# Altium project analogtestboard.PRJPCB
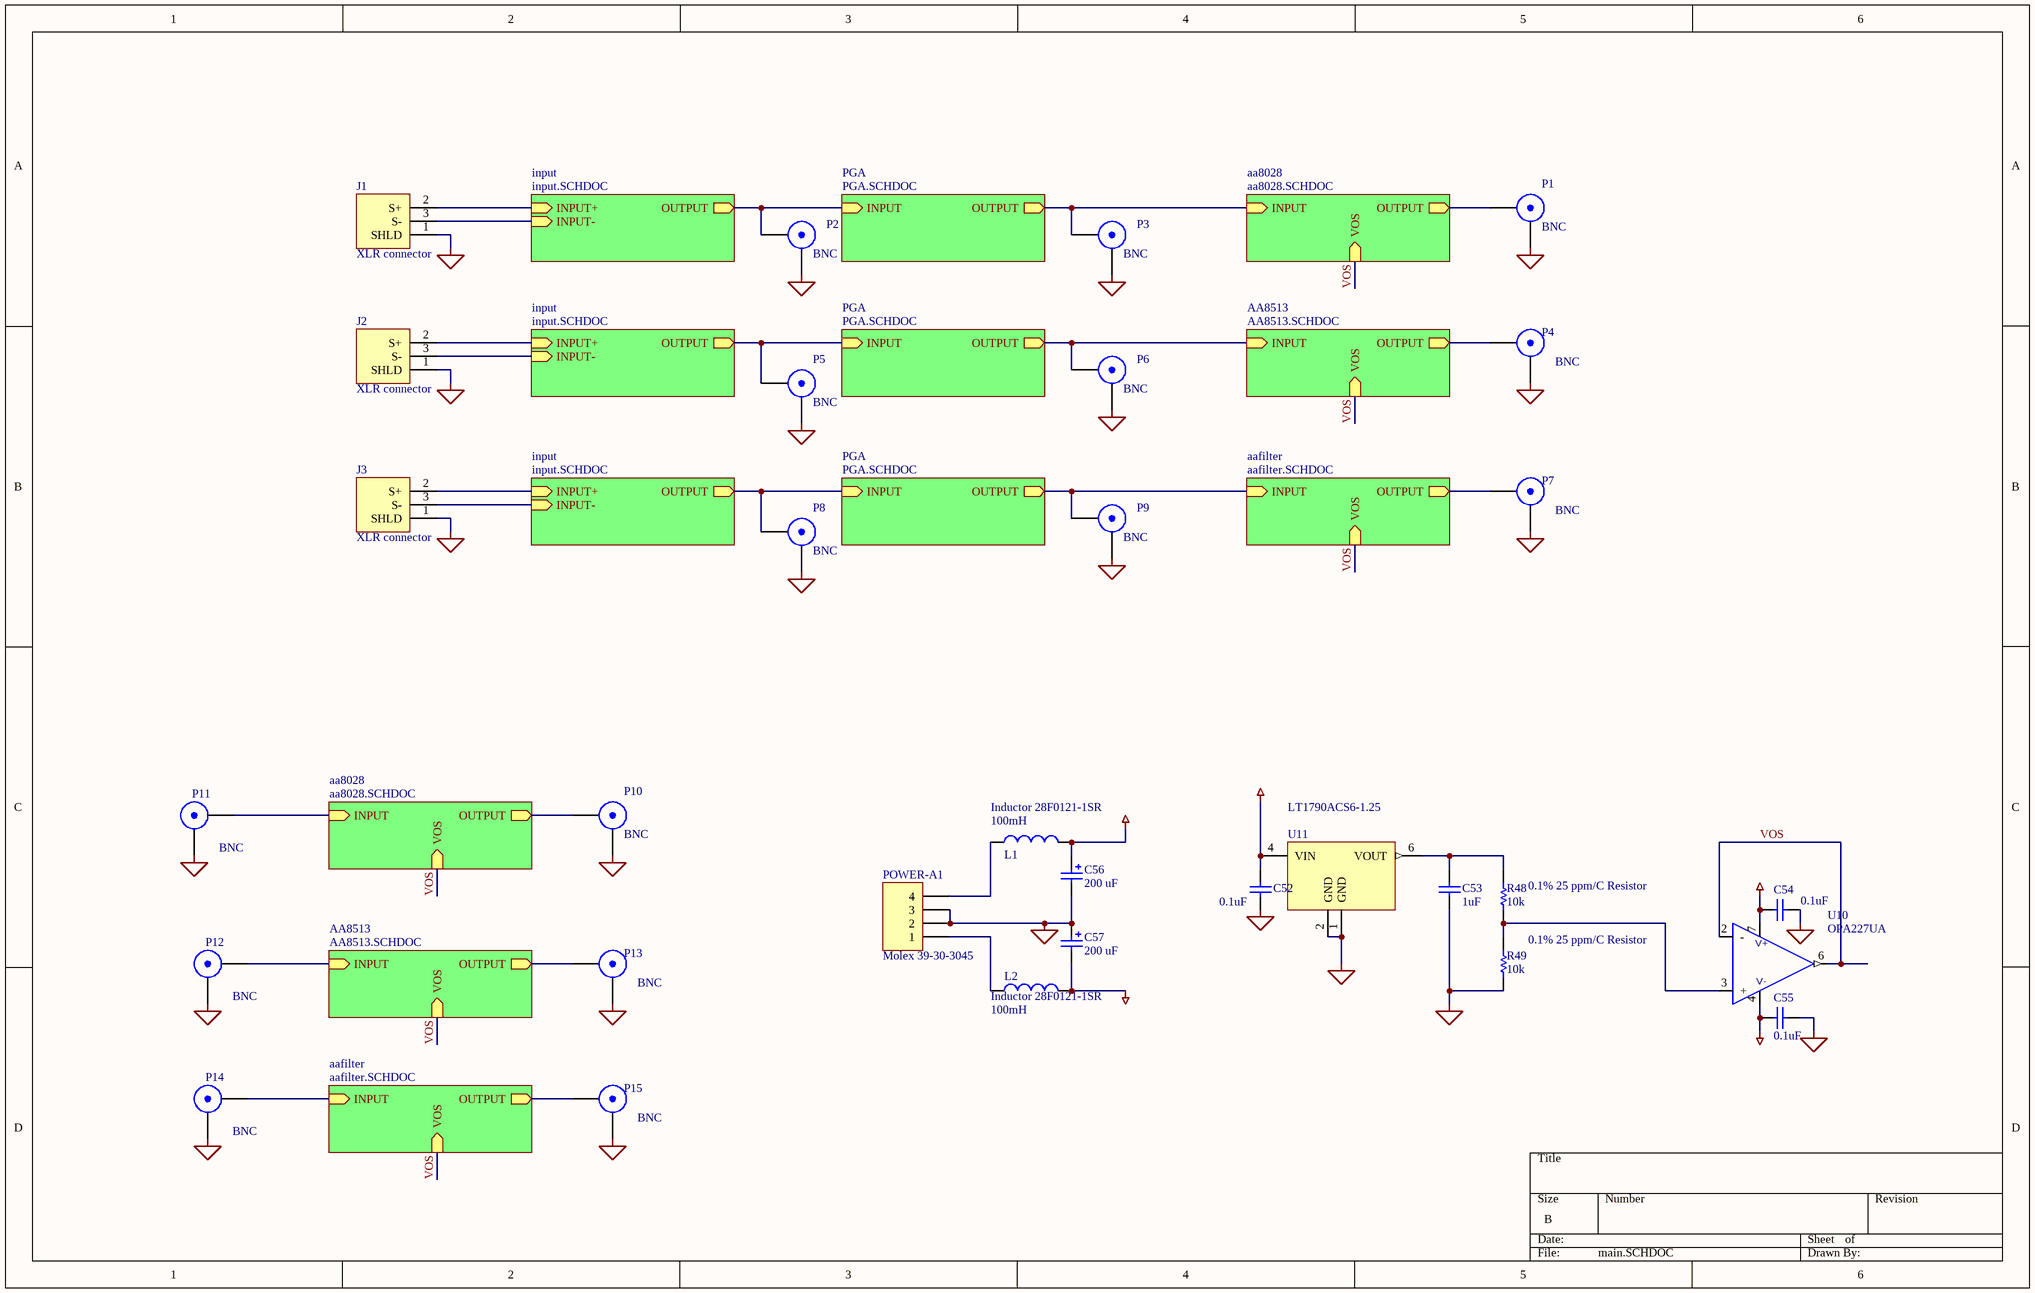
[diagram p0: main.SCHDOC]
5 sheets, 273 parts. Net scope: hierarchical (ports join the sheet entries above them; power ports are global).
Board file: analogtestboard.PCBDOC
Sheets:
  main.SCHDOC
    aa8028 = aa8028.SCHDOC
    AA8513 = AA8513.SCHDOC
    PGA = PGA.SCHDOC
    PGA = PGA.SCHDOC
    aafilter = aafilter.SCHDOC
    aa8028 = aa8028.SCHDOC
    AA8513 = AA8513.SCHDOC
    aafilter = aafilter.SCHDOC
    PGA = PGA.SCHDOC

## Sheet main.SCHDOC
size B

### Parts
(Parts that share a designator on the sheet are numbered #1, #2 ... from top to bottom, then left to right.)
C52#1  value 0.1uF  [CC1608-0603]  (hidden comment: Cap)
C53#1  value 1uF  [CC1608-0603]  (hidden comment: Cap)
C54#1  value 0.1uF  [CC1608-0603]  (hidden comment: Cap)
C55#1  value 0.1uF  [CC1608-0603]  (hidden comment: Cap)
C56  value 200 uF  [PanasonicE]
C57  value 200 uF  [PanasonicE]
J1  XLR connector  [NC3FAH-0]
J2  XLR connector  [NC3FAH-0]
J3  XLR connector  [NC3FAH-0]
L1  Inductor 28F0121-1SR  value 100mH  [STEWARD_1SR]
L2  Inductor 28F0121-1SR  value 100mH  [STEWARD_1SR]
P1  BNC  [Vertical BNC 227699-1]
P2  BNC  [Vertical BNC 227699-1]
P3  BNC  [Vertical BNC 227699-1]
P4  BNC  [Vertical BNC 227699-1]
P5  BNC  [Vertical BNC 227699-1]
P6  BNC  [Vertical BNC 227699-1]
P7  BNC  [Vertical BNC 227699-1]
P8  BNC  [Vertical BNC 227699-1]
P9  BNC  [Vertical BNC 227699-1]
P10  BNC  [Vertical BNC 227699-1]
P11  BNC  [Vertical BNC 227699-1]
P12  BNC  [Vertical BNC 227699-1]
P13  BNC  [Vertical BNC 227699-1]
P14  BNC  [Vertical BNC 227699-1]
P15  BNC  [Vertical BNC 227699-1]
POWER-A1  Molex 39-30-3045  [MJ4RTHR]
R48#1  0.1% 25 ppm/C Resistor  value 10k  [C3216-1206]
R49#1  0.1% 25 ppm/C Resistor  value 10k  [C3216-1206]
U10#1  OPA227UA  [SO-G8/D5.1]
U11#1  LT1790ACS6-1.25  [LTI SOT-23 ThinSOT]

### Sub-sheets
aa8028 = aa8028.SCHDOC: OUTPUT (out), INPUT (in), VOS (in)
aa8028 = aa8028.SCHDOC: OUTPUT (out), INPUT (in), VOS (in)
AA8513 = AA8513.SCHDOC: OUTPUT (out), INPUT (in), VOS (in)
AA8513 = AA8513.SCHDOC: OUTPUT (out), INPUT (in), VOS (in)
aafilter = aafilter.SCHDOC: INPUT (in), VOS (in), OUTPUT (out)
aafilter = aafilter.SCHDOC: INPUT (in), VOS (in), OUTPUT (out)
input = input.SCHDOC (file not in this document): INPUT+ (in), INPUT- (in), OUTPUT (out)
input = input.SCHDOC (file not in this document): INPUT+ (in), INPUT- (in), OUTPUT (out)
input = input.SCHDOC (file not in this document): INPUT+ (in), INPUT- (in), OUTPUT (out)
PGA = PGA.SCHDOC: OUTPUT (out), INPUT (in)
PGA = PGA.SCHDOC: OUTPUT (out), INPUT (in)
PGA = PGA.SCHDOC: OUTPUT (out), INPUT (in)

### Nets
AVDD: C52#1.1 C54#1.2 C56.1 L1.2 U10#1.7(V+) U11#1.4(VIN)
AVSS: C55#1.2 C57.2 L2.2 U10#1.4(V-)
GND: C52#1.2 C53#1.2 C54#1.1 C55#1.1 C56.2 C57.1 J1.1(SHLD) J2.1(SHLD) J3.1(SHLD) P1.2(Y) P2.2(Y) P3.2(Y) P4.2(Y) P5.2(Y) P6.2(Y) P7.2(Y) P8.2(Y) P9.2(Y) P10.2(Y) P11.2(Y) P12.2(Y) P13.2(Y) P14.2(Y) P15.2(Y) POWER-A1.2 POWER-A1.3 R49#1.1 U11#1.1(GND) U11#1.2(GND)
VOS: U10#1.2(-) U10#1.6(Vout) ; sheet aa8028/VOS, sheet AA8513/VOS, sheet aafilter/VOS, sheet aa8028/VOS, sheet AA8513/VOS, sheet aafilter/VOS
NetC18_1: P13.1(X) ; sheet AA8513/OUTPUT
NetC23_2: P5.1(X) ; sheet input/OUTPUT, sheet PGA/INPUT
NetC26_2: P2.1(X) ; sheet input/OUTPUT, sheet PGA/INPUT
NetC29_2: P8.1(X) ; sheet input/OUTPUT, sheet PGA/INPUT
NetC36_1: P10.1(X) ; sheet aa8028/OUTPUT
NetC53#1_1: C53#1.1 R48#1.2 U11#1.6(VOUT)
NetC63_1: P4.1(X) ; sheet AA8513/OUTPUT
NetC69_1: P7.1(X) ; sheet aafilter/OUTPUT
NetC70_1: P1.1(X) ; sheet aa8028/OUTPUT
NetC71_1: P15.1(X) ; sheet aafilter/OUTPUT
NetJ1_2: J1.2(S+) ; sheet input/INPUT+
NetJ1_3: J1.3(S-) ; sheet input/INPUT-
NetJ2_2: J2.2(S+) ; sheet input/INPUT+
NetJ2_3: J2.3(S-) ; sheet input/INPUT-
NetJ3_2: J3.2(S+) ; sheet input/INPUT+
NetJ3_3: J3.3(S-) ; sheet input/INPUT-
NetL1_1: L1.1 POWER-A1.4
NetL2_1: L2.1 POWER-A1.1
NetP3_1: P3.1(X) ; sheet PGA/OUTPUT, sheet aa8028/INPUT
NetP6_1: P6.1(X) ; sheet PGA/OUTPUT, sheet AA8513/INPUT
NetP9_1: P9.1(X) ; sheet aafilter/INPUT, sheet PGA/OUTPUT
NetP11_1: P11.1(X) ; sheet aa8028/INPUT
NetP12_1: P12.1(X) ; sheet AA8513/INPUT
NetP14_1: P14.1(X) ; sheet aafilter/INPUT
NetR48#1_1: R48#1.1 R49#1.2 U10#1.3(+)

### Library data of the parts
C52#1 C53#1 C54#1 C55#1 = Cap: Capacitor; Manufacturer: Generic Components; Class I: Passive; Published: 8-Jun-2000; Revision: July-2002: Re-released for DXP Platform.; Publisher: Altium Limited; Class II: Capacitor
C56 C57 = Cap Pol3: Polarized Capacitor (Surface Mount); Manufacturer: Generic Components; Class I: Passive; Published: 8-Jun-2000; Revision: July-2002: Re-released for DXP Platform.; Publisher: Altium Limited; Class II: Capacitor
J1-J3 = XLR: XLR balanced connector, standard
L1 L2 = Inductor: Manufacturer: Generic Components; Class I: Passive; Published: 8-Jun-2000; Revision: July-2002: Re-released for DXP Platform.; Publisher: Altium Limited; Class II: Inductor
P1-P15 = BNC: BNC Elbow Connector; Manufacturer: Generic Components; Class II: RF Coaxial; Revision: July-2002: Re-released for DXP Platform.; Publisher: Altium Limited; Class I: Connector
POWER-A1 = Header 4: Header, 4-Pin; Manufacturer: Generic Components; Class I: Connector; Revision: July-2002: Re-released for DXP Platform.; Publisher: Altium Limited
R48#1 R49#1 = Res1: Resistor; Manufacturer: Generic Components; Class I: Passive; Published: 8-Jun-2000; Revision: July-2002: Re-released for DXP Platform.; Publisher: Altium Limited; Class II: Resistor
U11#1 = LT1790

## Sheet aa8028.SCHDOC
size B
Used 2 times, as channels aa8028, aa8028. Parts and nets are listed once, with the designators drawn on the sheet.
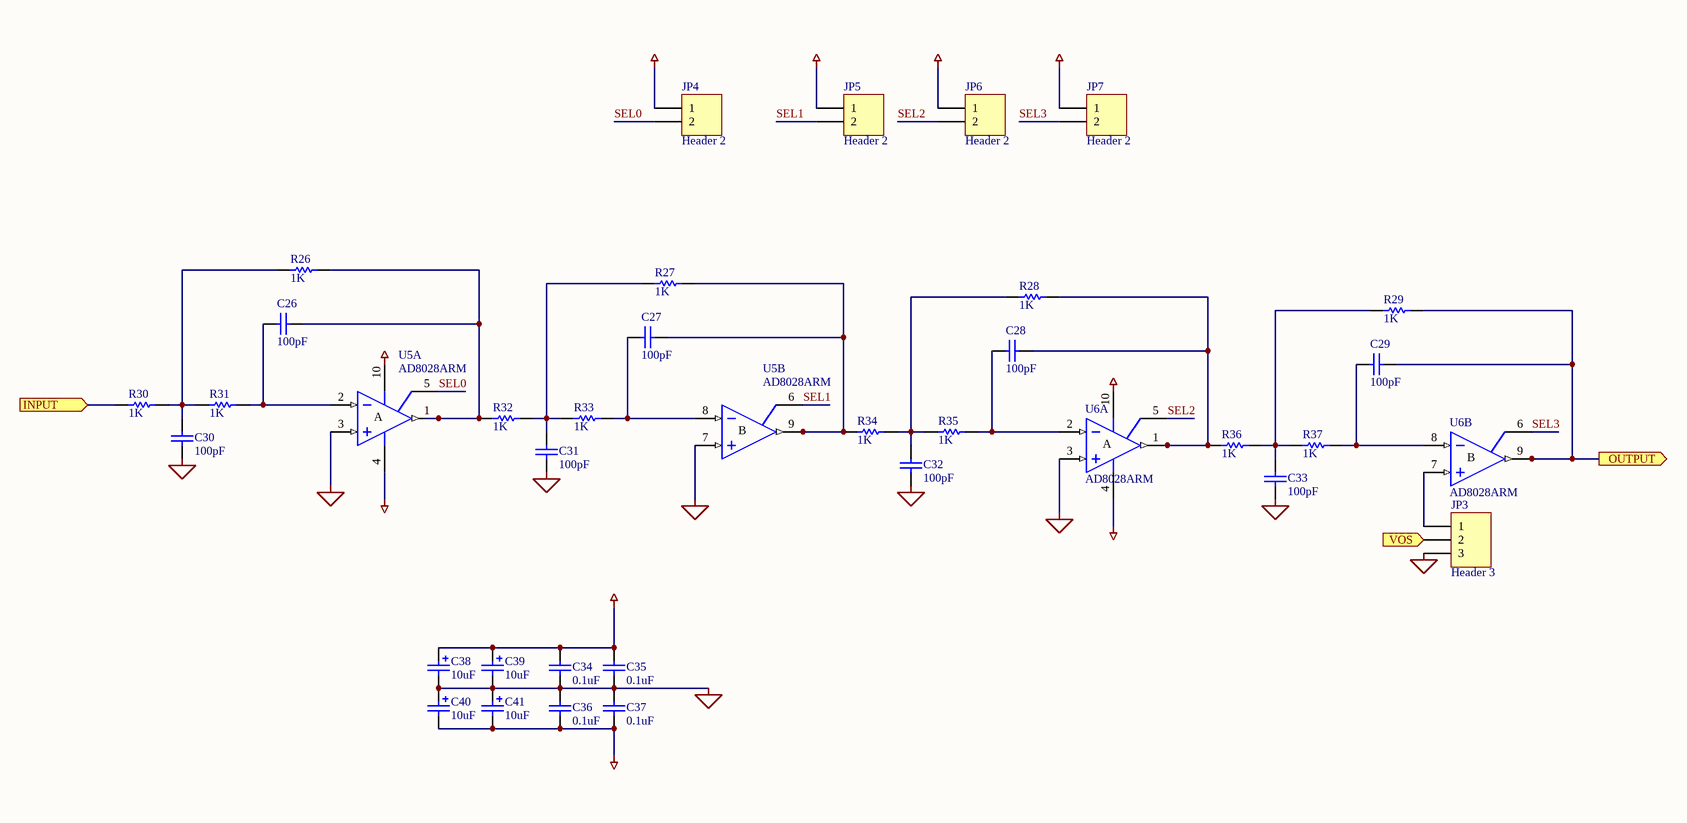
[diagram p1: aa8028.SCHDOC]

### Parts
C26  value 100pF  [CC3216-1206]  (hidden comment: Cap)
C27  value 100pF  [CC3216-1206]  (hidden comment: Cap)
C28  value 100pF  [CC3216-1206]  (hidden comment: Cap)
C29  value 100pF  [CC3216-1206]  (hidden comment: Cap)
C30  value 100pF  [CC3216-1206]  (hidden comment: Cap)
C31  value 100pF  [CC3216-1206]  (hidden comment: Cap)
C32  value 100pF  [CC3216-1206]  (hidden comment: Cap)
C33  value 100pF  [CC3216-1206]  (hidden comment: Cap)
C34  value 0.1uF  [CC1608-0603]  (hidden comment: Cap)
C35  value 0.1uF  [CC1608-0603]  (hidden comment: Cap)
C36  value 0.1uF  [CC1608-0603]  (hidden comment: Cap)
C37  value 0.1uF  [CC1608-0603]  (hidden comment: Cap)
C38  value 10uF  [TC7360-2924]  (hidden comment: Cap Pol1)
C39  value 10uF  [TC7360-2924]  (hidden comment: Cap Pol1)
C40  value 10uF  [TC7360-2924]  (hidden comment: Cap Pol1)
C41  value 10uF  [TC7360-2924]  (hidden comment: Cap Pol1)
JP3  Header 3  [HDR1X3]
JP4  Header 2  [HDR1X2]
JP5  Header 2  [HDR1X2]
JP6  Header 2  [HDR1X2]
JP7  Header 2  [HDR1X2]
R26  value 1K  [CC2012-0805]  (hidden comment: Res1)
R27  value 1K  [CC2012-0805]  (hidden comment: Res1)
R28  value 1K  [CC2012-0805]  (hidden comment: Res1)
R29  value 1K  [CC2012-0805]  (hidden comment: Res1)
R30  value 1K  [CC2012-0805]  (hidden comment: Res1)
R31  value 1K  [CC2012-0805]  (hidden comment: Res1)
R32  value 1K  [CC2012-0805]  (hidden comment: Res1)
R33  value 1K  [CC2012-0805]  (hidden comment: Res1)
R34  value 1K  [CC2012-0805]  (hidden comment: Res1)
R35  value 1K  [CC2012-0805]  (hidden comment: Res1)
R36  value 1K  [CC2012-0805]  (hidden comment: Res1)
R37  value 1K  [CC2012-0805]  (hidden comment: Res1)
U5  AD8028ARM  [TSSO3x5-G10]  (parts A,B of 2)
U6  AD8028ARM  [TSSO3x5-G10]  (parts A,B of 2)

### Ports
INPUT (in), OUTPUT (out), VOS (in)

### Nets
AVDD: C34.2 C35.2 C38.1 C39.1 JP4.1 JP5.1 JP6.1 JP7.1 U5.10(V+) U6.10(V+)
AVSS: C36.1 C37.1 C40.2 C41.2 U5.4(V-) U6.4(V-)
GND: C30.1 C31.1 C32.1 C33.1 C34.1 C35.1 C36.2 C37.2 C38.2 C39.2 C40.1 C41.1 JP3.3 U5.3(IN+A) U5.7(IN+B) U6.3(IN+A)
INPUT: R30.1 ; port INPUT
OUTPUT: C29.1 R29.1 U6.9(VOUTB) ; port OUTPUT
SEL0: JP4.2 U5.5(SELA)
SEL1: JP5.2 U5.6(SELB)
SEL2: JP6.2 U6.5(SELA)
SEL3: JP7.2 U6.6(SELB)
VOS: JP3.2 ; port VOS
NetC26_1: C26.1 R26.1 R32.1 U5.1(VOUTA)
NetC26_2: C26.2 R31.2 U5.2(IN-A)
NetC27_1: C27.1 R27.1 R34.1 U5.9(VOUTB)
NetC27_2: C27.2 R33.2 U5.8(IN-B)
NetC28_1: C28.1 R28.1 R36.1 U6.1(VOUTA)
NetC28_2: C28.2 R35.2 U6.2(IN-A)
NetC29_2: C29.2 R37.2 U6.8(IN-B)
NetC30_2: C30.2 R26.2 R30.2 R31.1
NetC31_2: C31.2 R27.2 R32.2 R33.1
NetC32_2: C32.2 R28.2 R34.2 R35.1
NetC33_2: C33.2 R29.2 R36.2 R37.1
NetJP3_1: JP3.1 U6.7(IN+B)

### Channels
aa8028: designators C26=C5 C27=C20 C28=C33 C29=C36 C30=C2 C31=C13 C32=C19 C33=C32 C34=C81 C35=C84 C36=C73 C37=C83 C38=C35 C39=C14 C40=C7 C41=C37 JP3=JP6 JP4=JP1 JP5=JP2 JP6=JP4 JP7=JP3 R26=R7 R27=R15 R28=R24 R29=R39 R30=R2 R31=R6 R32=R10 R33=R14 R34=R20 R35=R21 R36=R25 R37=R38 U5=U4 U6=U6; ports INPUT=NetP11_1 OUTPUT=NetC36_1 VOS=VOS
aa8028: designators C26=C49 C27=C59 C28=C66 C29=C70 C30=C46 C31=C54#2 C32=C58 C33=C65 C34=C99 C35=C107 C36=C98 C37=C106 C38=C68 C39=C55#2 C40=C52#2 C41=C72 JP3=JP15 JP4=JP10 JP5=JP11 JP6=JP13 JP7=JP12 R26=R75 R27=R89 R28=R101 R29=R108 R30=R67 R31=R74 R32=R80 R33=R86 R34=R96 R35=R97 R36=R105 R37=R106 U5=U18 U6=U23; ports INPUT=NetP3_1 OUTPUT=NetC70_1 VOS=VOS

### Notes on the sheet
- (in symbol AD8028ARM, part A) A
- (in symbol AD8028ARM, part B) B

### Library data of the parts
C26-C37 = Cap: as C52#1 on sheet main; Published: 8-Jun-2000; Revision: July-2002: Re-released for DXP Platform.; Publisher: Altium Limited; Class II: Capacitor
C38-C41 = Cap Pol1: Polarized Capacitor (Radial); Manufacturer: Generic Components; Class I: Passive; Published: 8-Jun-2000; Revision: July-2002: Re-released for DXP Platform.; Publisher: Altium Limited; Class II: Capacitor
JP3 = Header 3: Header, 3-Pin; Manufacturer: Generic Components; Class I: Connector; Revision: July-2002: Re-released for DXP Platform.; Publisher: Altium Limited
JP4-JP7 = Header 2: Header, 2-Pin; Manufacturer: Generic Components; Class I: Connector; Revision: July-2002: Re-released for DXP Platform.; Publisher: Altium Limited
R26-R37 = Res1: as R48#1 on sheet main; Published: 8-Jun-2000; Revision: July-2002: Re-released for DXP Platform.; Publisher: Altium Limited; Class II: Resistor
U5 U6 = AD8028ARM: Analog Devices Low Distortion, High Speed RRIO OA

## Sheet AA8513.SCHDOC
size B
Used 2 times, as channels AA8513, AA8513. Parts and nets are listed once, with the designators drawn on the sheet.
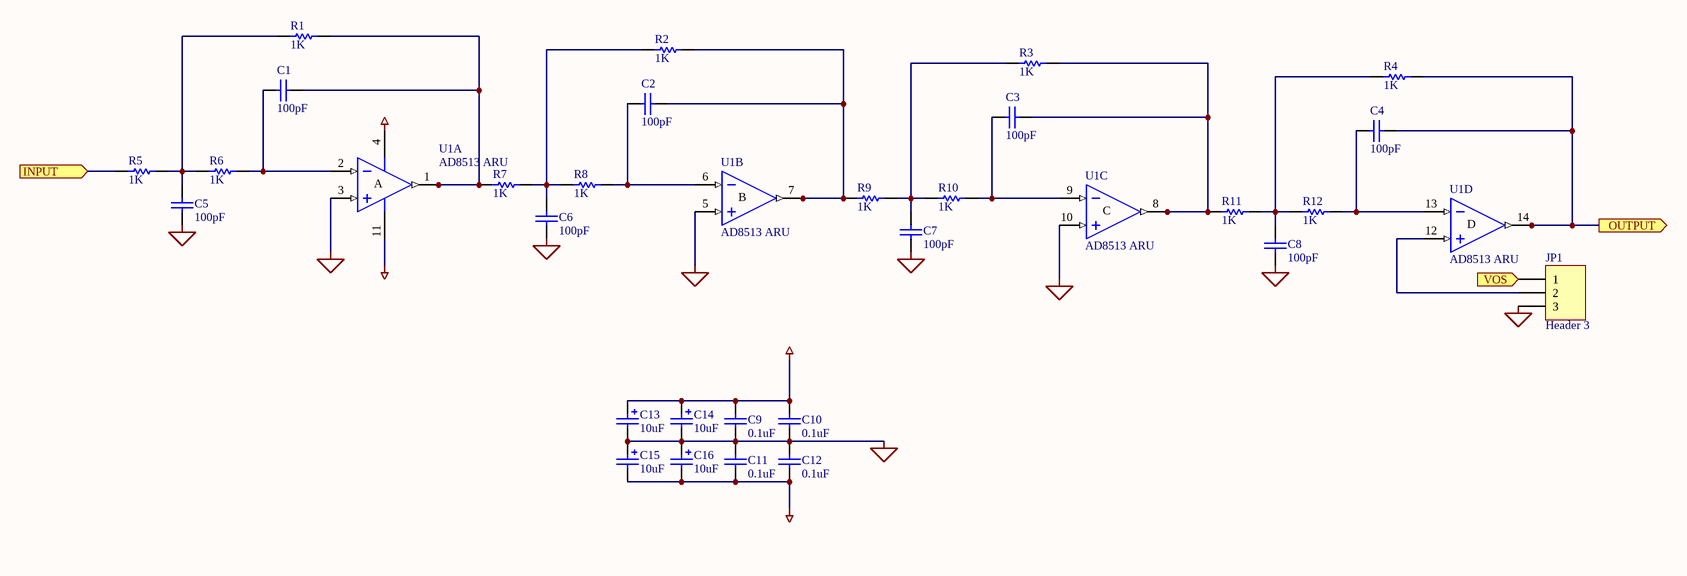
[diagram p2: AA8513.SCHDOC]

### Parts
C1  value 100pF  [CC3216-1206]  (hidden comment: Cap)
C2  value 100pF  [CC3216-1206]  (hidden comment: Cap)
C3  value 100pF  [CC3216-1206]  (hidden comment: Cap)
C4  value 100pF  [CC3216-1206]  (hidden comment: Cap)
C5  value 100pF  [CC3216-1206]  (hidden comment: Cap)
C6  value 100pF  [CC3216-1206]  (hidden comment: Cap)
C7  value 100pF  [CC3216-1206]  (hidden comment: Cap)
C8  value 100pF  [CC3216-1206]  (hidden comment: Cap)
C9  value 0.1uF  [CC1608-0603]  (hidden comment: Cap)
C10  value 0.1uF  [CC1608-0603]  (hidden comment: Cap)
C11  value 0.1uF  [CC1608-0603]  (hidden comment: Cap)
C12  value 0.1uF  [CC1608-0603]  (hidden comment: Cap)
C13  value 10uF  [TC7360-2924]  (hidden comment: Cap Pol1)
C14  value 10uF  [TC7360-2924]  (hidden comment: Cap Pol1)
C15  value 10uF  [TC7360-2924]  (hidden comment: Cap Pol1)
C16  value 10uF  [TC7360-2924]  (hidden comment: Cap Pol1)
JP1  Header 3  [HDR1X3]
R1  value 1K  [CC2012-0805]  (hidden comment: Res1)
R2  value 1K  [CC2012-0805]  (hidden comment: Res1)
R3  value 1K  [CC2012-0805]  (hidden comment: Res1)
R4  value 1K  [CC2012-0805]  (hidden comment: Res1)
R5  value 1K  [CC2012-0805]  (hidden comment: Res1)
R6  value 1K  [CC2012-0805]  (hidden comment: Res1)
R7  value 1K  [CC2012-0805]  (hidden comment: Res1)
R8  value 1K  [CC2012-0805]  (hidden comment: Res1)
R9  value 1K  [CC2012-0805]  (hidden comment: Res1)
R10  value 1K  [CC2012-0805]  (hidden comment: Res1)
R11  value 1K  [CC2012-0805]  (hidden comment: Res1)
R12  value 1K  [CC2012-0805]  (hidden comment: Res1)
U1  AD8513 ARU  [TSSO5X6-G14/X.3]  (parts A,B,C,D of 4)

### Ports
INPUT (in), OUTPUT (out), VOS (in)

### Nets
AVDD: C9.2 C10.2 C13.1 C14.1 U1.4(V+)
AVSS: C11.1 C12.1 C15.2 C16.2 U1.11(V-)
GND: C5.1 C6.1 C7.1 C8.1 C9.1 C10.1 C11.2 C12.2 C13.2 C14.2 C15.1 C16.1 JP1.3 U1.3(IN+A) U1.5(IN+B) U1.10(IN+C)
INPUT: R5.1 ; port INPUT
OUTPUT: C4.1 R4.1 U1.14(OUTD) ; port OUTPUT
VOS: JP1.1 ; port VOS
NetC1_1: C1.1 R1.1 R7.1 U1.1(OUTA)
NetC1_2: C1.2 R6.2 U1.2(IN-A)
NetC2_1: C2.1 R2.1 R9.1 U1.7(OUTB)
NetC2_2: C2.2 R8.2 U1.6(IN-B)
NetC3_1: C3.1 R3.1 R11.1 U1.8(OUTC)
NetC3_2: C3.2 R10.2 U1.9(IN-C)
NetC4_2: C4.2 R12.2 U1.13(IN-D)
NetC5_2: C5.2 R1.2 R5.2 R6.1
NetC6_2: C6.2 R2.2 R7.2 R8.1
NetC7_2: C7.2 R3.2 R9.2 R10.1
NetC8_2: C8.2 R4.2 R11.2 R12.1
NetJP1_2: JP1.2 U1.12(IN+D)

### Channels
AA8513: designators C1=C4 C2=C12 C3=C22 C4=C18 C5=C1 C6=C3 C7=C21 C8=C34 C9=C80 C10=C10_AA8513#1 C11=C82 C12=C12_AA8513#1 C13=C13_AA8513#1 C14=C11 C15=C6 C16=C16_AA8513#1 JP1=JP5 R1=R5 R2=R13 R3=R22 R4=R19 R5=R1 R6=R3 R7=R11 R8=R12 R9=R16 R10=R17 R11=R23 R12=R18 U1=U5; ports INPUT=NetP12_1 OUTPUT=NetC18_1 VOS=VOS
AA8513: designators C1=C48 C2=C53#2 C3=C62 C4=C63 C5=C45 C6=C47 C7=C61 C8=C67 C9=C101 C10=C10_AA8513#2 C11=C103 C12=C12_AA8513#2 C13=C13_AA8513#2 C14=C50 C15=C51 C16=C16_AA8513#2 JP1=JP14 R1=R79 R2=R88 R3=R100 R4=R95 R5=R71 R6=R72 R7=R84 R8=R83 R9=R90 R10=R93 R11=R104 R12=R94 U1=U20; ports INPUT=NetP6_1 OUTPUT=NetC63_1 VOS=VOS

### Notes on the sheet
- (in symbol AD8513ARU, part A) A
- (in symbol AD8513ARU, part B) B
- (in symbol AD8513ARU, part C) C
- (in symbol AD8513ARU, part D) D

### Library data of the parts
C1-C12 = Cap: as C52#1 on sheet main; Published: 8-Jun-2000; Revision: July-2002: Re-released for DXP Platform.; Publisher: Altium Limited; Class II: Capacitor
C13-C16 = Cap Pol1: as C38 on sheet aa8028; Published: 8-Jun-2000; Revision: July-2002: Re-released for DXP Platform.; Publisher: Altium Limited; Class II: Capacitor
JP1 = Header 3: as JP3 on sheet aa8028; Revision: July-2002: Re-released for DXP Platform.; Publisher: Altium Limited
R1-R12 = Res1: as R48#1 on sheet main; Published: 8-Jun-2000; Revision: July-2002: Re-released for DXP Platform.; Publisher: Altium Limited; Class II: Resistor
U1 = AD8513ARU: low-noise JFET quad OA

## Sheet PGA.SCHDOC
size B
Used 3 times, as channels PGA, PGA, PGA. Parts and nets are listed once, with the designators drawn on the sheet.
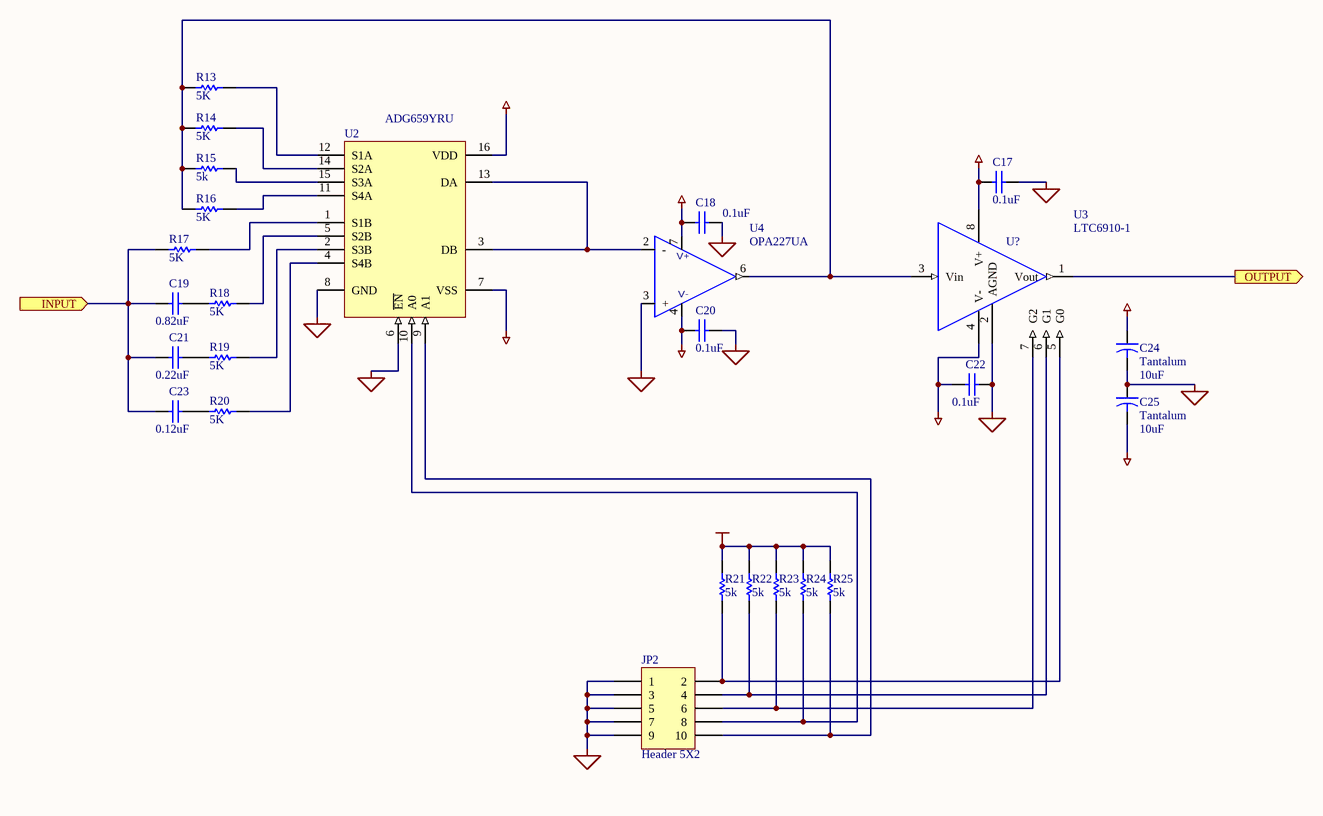
[diagram p3: PGA.SCHDOC]

### Parts
C17  value 0.1uF  [CC1608-0603]  (hidden comment: Cap)
C18  value 0.1uF  [CC1608-0603]  (hidden comment: Cap)
C19  value 0.82uF  [CC1608-0603]  (hidden comment: Cap)
C20  value 0.1uF  [CC1608-0603]  (hidden comment: Cap)
C21  value 0.22uF  [CC1608-0603]  (hidden comment: Cap)
C22  value 0.1uF  [CC1608-0603]  (hidden comment: Cap)
C23  value 0.12uF  [CC1608-0603]  (hidden comment: Cap)
C24  Tantalum  value 10uF  [TC3216-1206]
C25  Tantalum  value 10uF  [TC3216-1206]
JP2  Header 5X2  [HDR2X5]
R13  value 5K  [CC1608-0603]  (hidden comment: Res1)
R14  value 5K  [CC1608-0603]  (hidden comment: Res1)
R15  value 5k  [CC1608-0603]  (hidden comment: Res1)
R16  value 5K  [CC1608-0603]  (hidden comment: Res1)
R17  value 5K  [CC1608-0603]  (hidden comment: Res1)
R18  value 5K  [CC1608-0603]  (hidden comment: Res1)
R19  value 5K  [CC1608-0603]  (hidden comment: Res1)
R20  value 5K  [CC1608-0603]  (hidden comment: Res1)
R21  value 5k  [CC2012-0805]  (hidden comment: Res1)
R22  value 5k  [CC2012-0805]  (hidden comment: Res1)
R23  value 5k  [CC2012-0805]  (hidden comment: Res1)
R24  value 5k  [CC2012-0805]  (hidden comment: Res1)
R25  value 5k  [CC2012-0805]  (hidden comment: Res1)
U2  ADG659YRU  [TSSO5X6-G16]
U3  LTC6910-1  [TSOT-23-8]
U4  OPA227UA  [SO-G8/D5.1]

### Ports
INPUT (in), OUTPUT (out)

### Nets
AVDD: C17.1 C18.2 C24.1 R21.2 R22.2 R23.2 R24.2 R25.2 U2.16(VDD) U3.8(V+) U4.7(V+)
AVSS: C20.2 C22.2 C25.2 U2.7(VSS) U3.4(V-) U4.4(V-)
GND: C17.2 C18.1 C20.1 C22.1 C24.2 C25.1 JP2.1 JP2.3 JP2.5 JP2.7 JP2.9 U2.6(~{EN}) U2.8(GND) U3.2(AGND) U4.3(+)
INPUT: C19.2 C21.2 C23.2 R17.1 ; port INPUT
OUTPUT: U3.1(Vout) ; port OUTPUT
NetC19_1: C19.1 R18.1
NetC21_1: C21.1 R19.1
NetC23_1: C23.1 R20.1
NetJP2_2: JP2.2 R21.1 U3.5(G0)
NetJP2_4: JP2.4 R22.1 U3.6(G1)
NetJP2_6: JP2.6 R23.1 U3.7(G2)
NetJP2_8: JP2.8 R24.1 U2.10(A0)
NetJP2_10: JP2.10 R25.1 U2.9(A1)
NetR13_1: R13.1 R14.1 R15.1 R16.1 U3.3(Vin) U4.6(Vout)
NetR13_2: R13.2 U2.12(S1A)
NetR14_2: R14.2 U2.14(S2A)
NetR15_2: R15.2 U2.15(S3A)
NetR16_2: R16.2 U2.11(S4A)
NetR17_2: R17.2 U2.1(S1B)
NetR18_2: R18.2 U2.5(S2B)
NetR19_2: R19.2 U2.2(S3B)
NetR20_2: R20.2 U2.4(S4B)
NetU2_3: U2.3(DB) U2.13(DA) U4.2(-)

### Channels
PGA: designators C17=C94 C18=C89 C19=C26 C20=C86 C21=C28 C22=C93 C23=C27 C24=C41 C25=C40 JP2=JP2_PGA#1 R13=R50 R14=R51 R15=R52 R16=R49#2 R17=R33 R18=R30 R19=R32 R20=R31 R21=R65 R22=R62 R23=R59 R24=R48#2 R25=R41 U2=U8 U3=U14 U4=U11#2; ports INPUT=NetC26_2 OUTPUT=NetP3_1
PGA: designators C17=C92 C18=C88 C19=C23 C20=C85 C21=C25 C22=C91 C23=C24 C24=C39 C25=C38 JP2=JP2_PGA#2 R13=R45 R14=R46 R15=R47 R16=R44 R17=R29 R18=R26 R19=R28 R20=R27 R21=R64 R22=R61 R23=R58 R24=R43 R25=R40 U2=U7 U3=U13 U4=U10#2; ports INPUT=NetC23_2 OUTPUT=NetP6_1
PGA: designators C17=C96 C18=C90 C19=C29 C20=C87 C21=C31 C22=C95 C23=C30 C24=C43 C25=C42 JP2=JP2_PGA#3 R13=R55 R14=R56 R15=R57 R16=R54 R17=R37 R18=R34 R19=R36 R20=R35 R21=R66 R22=R63 R23=R60 R24=R53 R25=R42 U2=U9 U3=U15 U4=U12; ports INPUT=NetC29_2 OUTPUT=NetP9_1

### Notes on the sheet
- (in symbol LTC6910-2) U?

### Library data of the parts
C17-C23 = Cap: as C52#1 on sheet main; Published: 8-Jun-2000; Revision: July-2002: Re-released for DXP Platform.; Publisher: Altium Limited; Class II: Capacitor
C24 C25 = Cap2: Capacitor; Manufacturer: Generic Components; Class I: Passive; Published: 23-Sep-2002; Publisher: Altium Limited; Class II: Capacitor
JP2 = Header 5X2: Header, 5-Pin, Dual row; Manufacturer: Generic Components; Class I: Connector; Revision: July-2002: Re-released for DXP Platform.; Publisher: Altium Limited
R13-R25 = Res1: as R48#1 on sheet main; Published: 8-Jun-2000; Revision: July-2002: Re-released for DXP Platform.; Publisher: Altium Limited; Class II: Resistor
U2 = ADG659: ADG659 4:1 Differential +/- 5V Mux
U3 = LTC6910-2: LTI Digitally Controlled Programmabe Gain Amp

## Sheet aafilter.SCHDOC
size B
Used 2 times, as channels aafilter, aafilter. Parts and nets are listed once, with the designators drawn on the sheet.
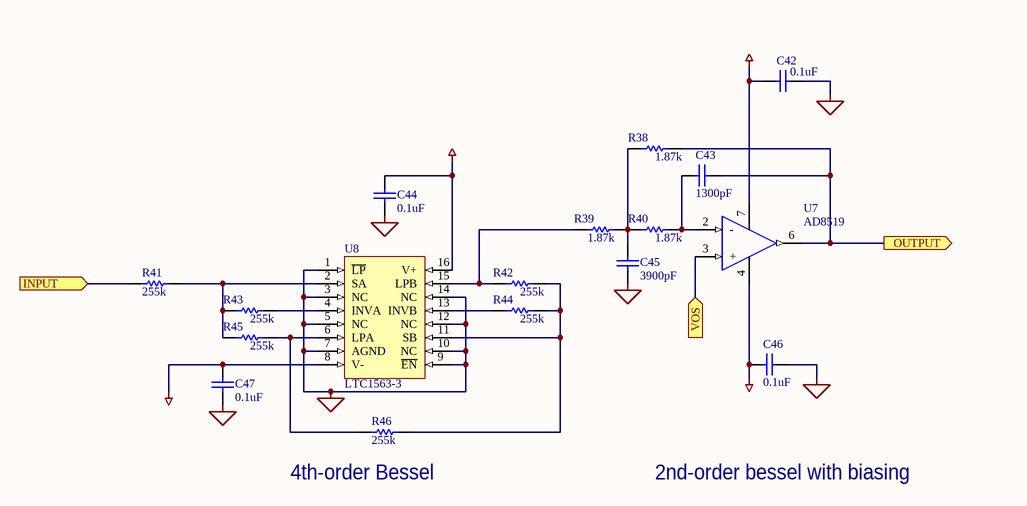
[diagram p4: aafilter.SCHDOC]

### Parts
C42  value 0.1uF  [CC1608-0603]  (hidden comment: Cap)
C43  value 1300pF  [CC1608-0603]  (hidden comment: Cap)
C44  value 0.1uF  [CC1608-0603]  (hidden comment: Cap)
C45  value 3900pF  [CC1608-0603]  (hidden comment: Cap)
C46  value 0.1uF  [CC1608-0603]  (hidden comment: Cap)
C47  value 0.1uF  [CC1608-0603]  (hidden comment: Cap)
R38  value 1.87k  [R2012-0805]  (hidden comment: Res1)
R39  value 1.87k  [R2012-0805]  (hidden comment: Res1)
R40  value 1.87k  [R2012-0805]  (hidden comment: Res1)
R41  value 255k  [R2012-0805]  (hidden comment: Res1)
R42  value 255k  [R2012-0805]  (hidden comment: Res1)
R43  value 255k  [R2012-0805]  (hidden comment: Res1)
R44  value 255k  [R2012-0805]  (hidden comment: Res1)
R45  value 255k  [R2012-0805]  (hidden comment: Res1)
R46  value 255k  [R2012-0805]  (hidden comment: Res1)
U7  AD8519  [SO-G8/X.6]
U8  LTC1563-3  [SSO-G16/X.4]

### Ports
INPUT (in), OUTPUT (out), VOS (in)

### Nets
AVDD: C42.2 C44.2 U7.7(+Vs) U8.16(V+)
AVSS: C46.2 C47.2 U7.4(-Vs) U8.8(V-)
GND: C42.1 C44.1 C45.1 C46.1 C47.1 U8.1(~{LP}) U8.3(NC) U8.5(NC) U8.7(AGND) U8.9(~{EN}) U8.10(NC) U8.12(NC) U8.14(NC)
INPUT: R41.1 ; port INPUT
OUTPUT: C43.1 R38.2 U7.6(Out) ; port OUTPUT
VOS: U7.3(+) ; port VOS
NetC43_2: C43.2 R40.2 U7.2(-)
NetC45_2: C45.2 R38.1 R39.2 R40.1
NetR39_1: R39.1 R42.1 U8.15(LPB)
NetR41_2: R41.2 R43.1 R45.1 U8.2(SA)
NetR42_2: R42.2 R44.2 R46.2 U8.11(SB)
NetR43_2: R43.2 U8.4(INVA)
NetR44_1: R44.1 U8.13(INVB)
NetR45_2: R45.2 R46.1 U8.6(LPA)

### Channels
aafilter: designators C42=C110 C43=C71 C44=C104 C45=C64 C46=C109 C47=C100 R38=R110 R39=R103 R40=R107 R41=R78 R42=R99 R43=R82 R44=R92 R45=R77 R46=R85 U7=U24 U8=U21; ports INPUT=NetP14_1 OUTPUT=NetC71_1 VOS=VOS
aafilter: designators C42=C108 C43=C69 C44=C102 C45=C60 C46=C105 C47=C97 R38=R109 R39=R98 R40=R102 R41=R69 R42=R91 R43=R76 R44=R87 R45=R68 R46=R81 U7=U22 U8=U19; ports INPUT=NetP9_1 OUTPUT=NetC69_1 VOS=VOS

### Notes on the sheet
- (near R46) 4th-order Bessel
- 2nd-order bessel with biasing

### Library data of the parts
C42-C47 = Cap: as C52#1 on sheet main; Published: 8-Jun-2000; Revision: July-2002: Re-released for DXP Platform.; Publisher: Altium Limited; Class II: Capacitor
R38-R46 = Res1: as R48#1 on sheet main; Published: 8-Jun-2000; Revision: July-2002: Re-released for DXP Platform.; Publisher: Altium Limited; Class II: Resistor
U7 = AD8519: 8 MHz RRIO Op-Amp
U8 = LTC1563-3: Linear Tech 4-th order linear continuous filter

## Nets that join several sheets
AVDD: main (6 pins), aa8028 (10 pins), AA8513 (5 pins), PGA (11 pins), PGA (11 pins), aafilter (C104.2 C110.2 U21.16 U24.7), aa8028 (10 pins), AA8513 (5 pins), aafilter (C102.2 C108.2 U19.16 U22.7), PGA (11 pins)
AVSS: main (C55#1.2 C57.2 L2.2 U10#1.4), aa8028 (6 pins), AA8513 (5 pins), PGA (6 pins), PGA (6 pins), aafilter (C100.2 C109.2 U21.8 U24.4), aa8028 (6 pins), AA8513 (5 pins), aafilter (C97.2 C105.2 U19.8 U22.4), PGA (6 pins)
GND: main (29 pins), aa8028 (16 pins), AA8513 (16 pins), PGA (15 pins), PGA (15 pins), aafilter (13 pins), aa8028 (16 pins), AA8513 (16 pins), aafilter (13 pins), PGA (15 pins)
NetC18_1: main (P13.1), AA8513 (C18.1 R19.1 U5.14)
NetC23_2: main (P5.1), PGA (C23.2 C24.2 C25.2 R29.1)
NetC26_2: main (P2.1), PGA (C26.2 C27.2 C28.2 R33.1)
NetC29_2: main (P8.1), PGA (C29.2 C30.2 C31.2 R37.1)
NetC36_1: main (P10.1), aa8028 (C36.1 R39.1 U6.9)
NetC63_1: main (P4.1), AA8513 (C63.1 R95.1 U20.14)
NetC69_1: main (P7.1), aafilter (C69.1 R109.2 U22.6)
NetC70_1: main (P1.1), aa8028 (C70.1 R108.1 U23.9)
NetC71_1: main (P15.1), aafilter (C71.1 R110.2 U24.6)
NetP3_1: main (P3.1), PGA (U14.1), aa8028 (R67.1)
NetP6_1: main (P6.1), PGA (U13.1), AA8513 (R71.1)
NetP9_1: main (P9.1), aafilter (R69.1), PGA (U15.1)
NetP11_1: main (P11.1), aa8028 (R2.1)
NetP12_1: main (P12.1), AA8513 (R1.1)
NetP14_1: main (P14.1), aafilter (R78.1)
VOS: main (U10#1.2 U10#1.6), aa8028 (JP6.2), AA8513 (JP5.1), aafilter (U24.3), aa8028 (JP15.2), AA8513 (JP14.1), aafilter (U22.3)